# EAGLE schematic Mother_Board (EAGLE 7.5.0)
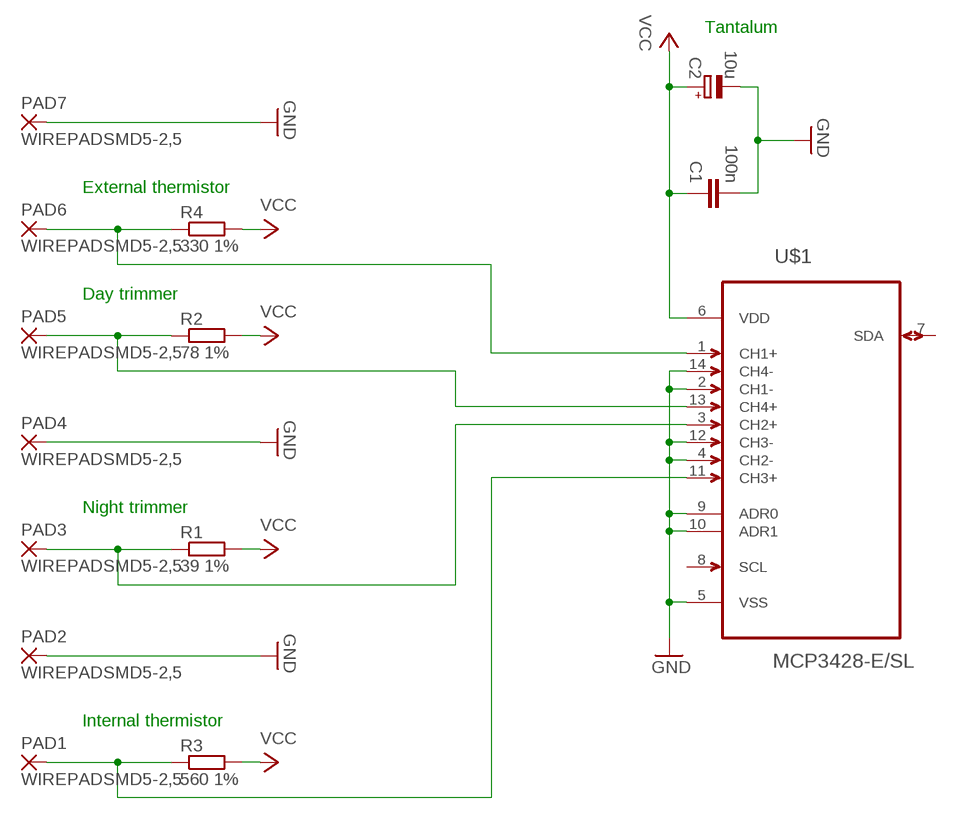
[diagram p0: schematic, sheet 1]

## Parts
C1  100n  C-EU050-035X075  [C050-035X075]
C2  10u  CPOL-EUB45181B  [B45181B]
PAD1  WIREPADSMD5-2,5  [5-2,5]
PAD2  WIREPADSMD5-2,5  [5-2,5]
PAD3  WIREPADSMD5-2,5  [5-2,5]
PAD4  WIREPADSMD5-2,5  [5-2,5]
PAD5  WIREPADSMD5-2,5  [5-2,5]
PAD6  WIREPADSMD5-2,5  [5-2,5]
PAD7  WIREPADSMD5-2,5  [5-2,5]
R1  39 1%  R-EU_0207/10  [0207/10]
R2  78 1%  R-EU_0207/10  [0207/10]
R3  560 1%  R-EU_0207/10  [0207/10]
R4  330 1%  R-EU_0207/10  [0207/10]
U$1  MCP3428-E/SL  [SOIC127P600X175-14N]

## Nets
GND: C1.2 C2.- PAD2.1(P) PAD4.1(P) PAD7.1(P) U$1.2(CH1-) U$1.4(CH2-) U$1.5(VSS) U$1.9(ADR0) U$1.10(ADR1) U$1.12(CH3-) U$1.14(CH4-)
N$1: PAD5.1(P) R2.1 U$1.13(CH4+)
N$2: PAD1.1(P) R3.1 U$1.11(CH3+)
N$8: PAD6.1(P) R4.1 U$1.1(CH1+)
PIN4: PAD3.1(P) R1.1 U$1.3(CH2+)
VCC: C1.1 C2.+ R1.2 R2.2 R3.2 R4.2 U$1.6(VDD)
Unconnected: U$1.7(SDA) U$1.8(SCL)

## Notes on the sheet
- Tantalum
- External thermistor
- Day trimmer
- Night trimmer
- Internal thermistor

## Library data of the parts
C1 = rcl:C-EU: CAPACITOR, European symbol
C2 = rcl:CPOL-EU: POLARIZED CAPACITOR, European symbol
PAD1-PAD7 = wirepad:WIREPAD: Wire PAD connect wire on PCB
R1-R4 = resistor:R-EU_: RESISTOR, European symbol
U$1 = MCP3428:MCP3428-E/SL: Analog-to-Digital Converter; MPN: MCP3428-E/SL; OC_FARNELL: 1825014; OC_NEWARK: 52R9962; PACKAGE: SOIC-14; SUPPLIER: Microchip